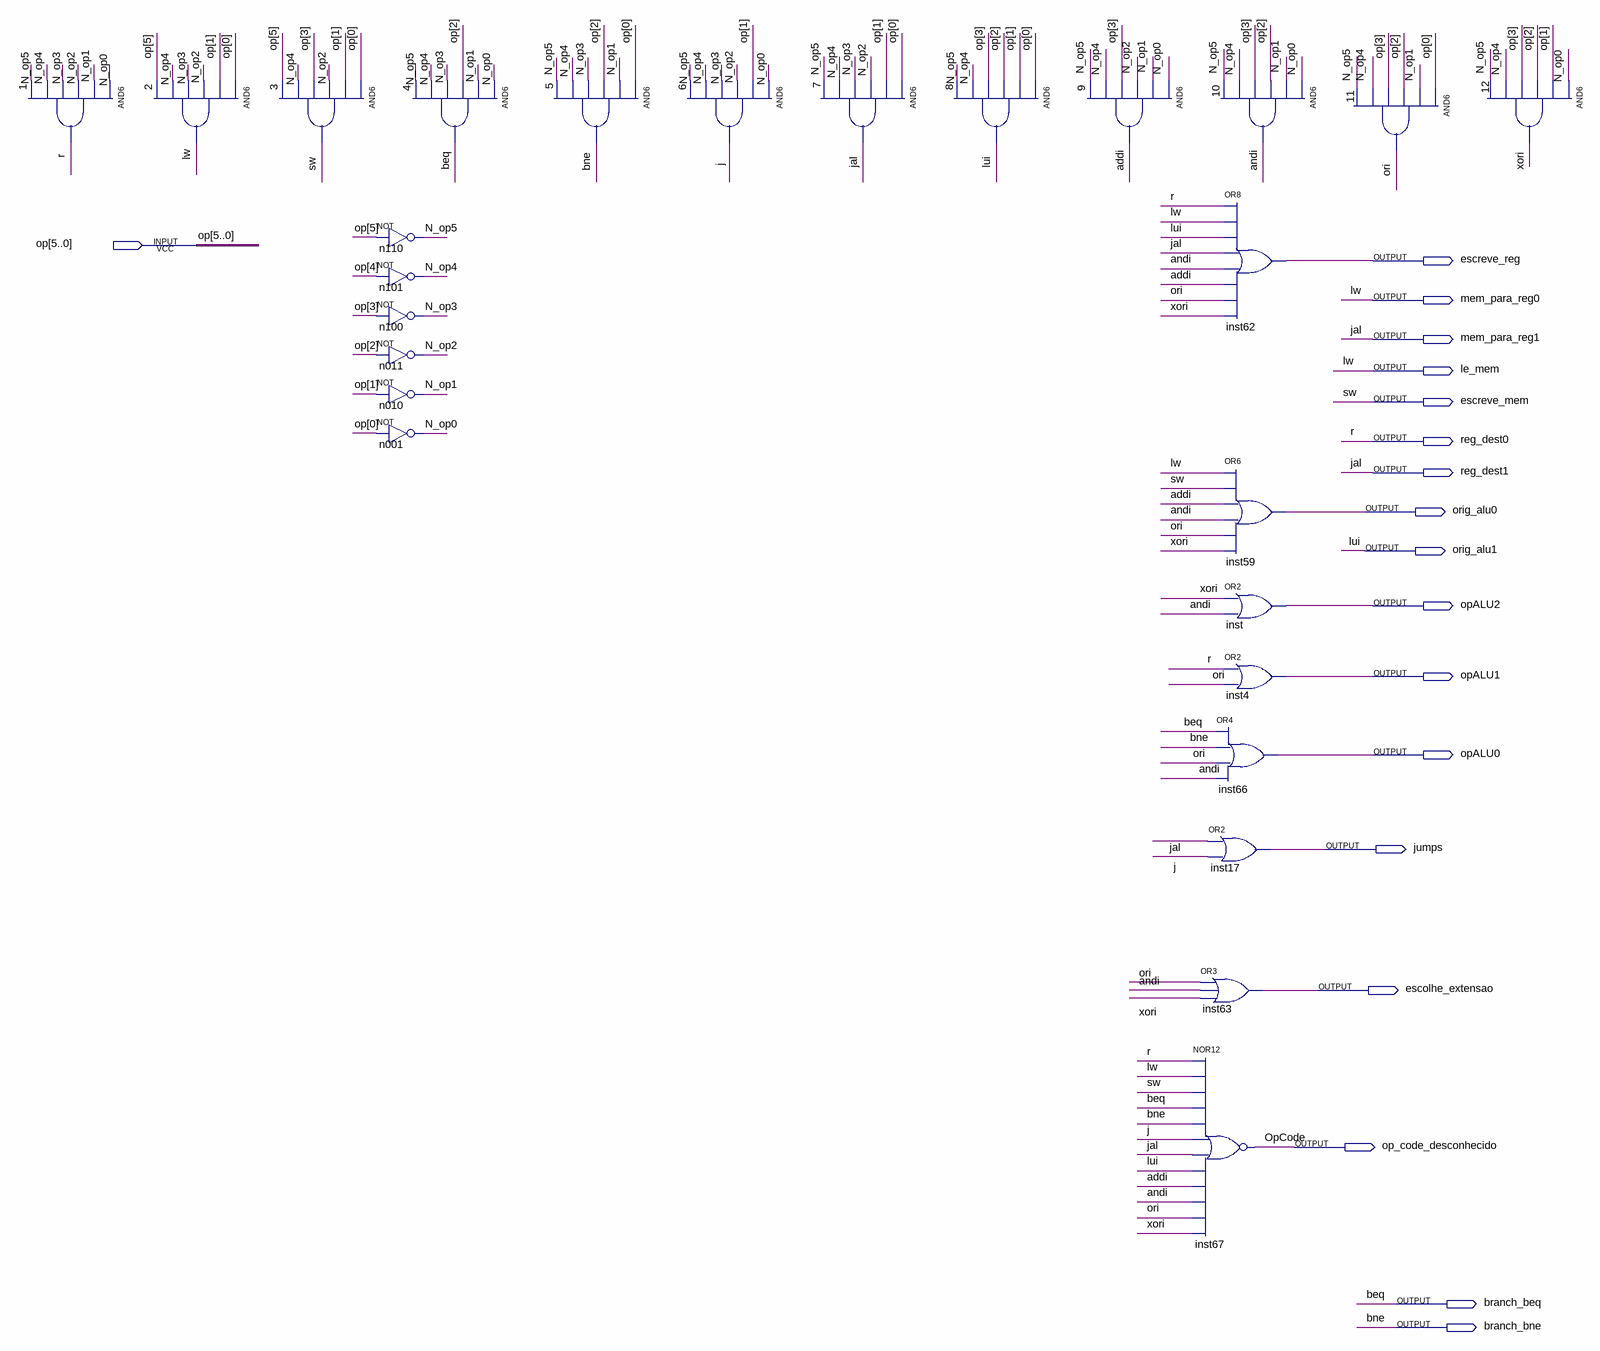
[diagram p0: schematic sheet]
// Quartus schematic control.bdf as structural Verilog: 26 symbols, 18 pins
module control (
  input  [5:0] op,
  output escreve_reg,
  output mem_para_reg0,
  output mem_para_reg1,
  output le_mem,
  output escreve_mem,
  output reg_dest0,
  output reg_dest1,
  output orig_alu0,
  output orig_alu1,
  output opALU2,
  output opALU1,
  output opALU0,
  output jumps,
  output escolhe_extensao,
  output op_code_desconhecido,
  output branch_beq,
  output branch_bne
);

  wire addi, andi, j, N_op0, N_op1, N_op2, N_op3, N_op4, N_op5, ori, xori;

  and u_1 (reg_dest0, N_op0, N_op1, N_op2, N_op3, N_op4, N_op5);
  and u_2 (le_mem, op[0], op[1], N_op2, N_op3, N_op4, op[5]);
  and u_3 (escreve_mem, op[0], op[1], N_op2, op[3], N_op4, op[5]);
  not n110 (N_op5, op[5]);
  not n101 (N_op4, op[4]);
  not n100 (N_op3, op[3]);
  not n011 (N_op2, op[2]);
  not n010 (N_op1, op[1]);
  not n001 (N_op0, op[0]);
  and u_4 (branch_beq, N_op0, N_op1, op[2], N_op3, N_op4, N_op5);
  and u_5 (branch_bne, op[0], N_op1, op[2], N_op3, N_op4, N_op5);
  and u_6 (j, N_op0, op[1], N_op2, N_op3, N_op4, N_op5);
  and u_7 (mem_para_reg1, op[0], op[1], N_op2, N_op3, N_op4, N_op5);
  and u_8 (orig_alu1, op[0], op[1], op[2], op[3], N_op4, N_op5);
  and u_9 (addi, N_op0, N_op1, N_op2, op[3], N_op4, N_op5);
  and u_10 (andi, N_op0, N_op1, op[2], op[3], N_op4, N_op5);
  or inst17 (jumps, mem_para_reg1, j);
  or inst63 (escolhe_extensao, ori, andi, xori);
  nor inst67 (op_code_desconhecido, reg_dest0, le_mem, escreve_mem, branch_beq, branch_bne, j, mem_para_reg1, orig_alu1, addi, andi, ori, xori);
  or inst62 (escreve_reg, reg_dest0, le_mem, orig_alu1, mem_para_reg1, andi, addi, ori, xori);
  or inst59 (orig_alu0, le_mem, escreve_mem, addi, andi, ori, xori);
  or inst (opALU2, xori, andi);
  or inst4 (opALU1, reg_dest0, ori);
  or inst66 (opALU0, branch_beq, branch_bne, ori, andi);
  and u_11 (ori, op[0], N_op1, op[2], op[3], N_op4, N_op5);
  and u_12 (xori, N_op0, op[1], op[2], op[3], N_op4, N_op5);

  assign mem_para_reg0 = le_mem;
  assign reg_dest1 = mem_para_reg1;

  // Other names for the same wires on the sheet: beq = branch_beq; bne = branch_bne; jal = mem_para_reg1;
  //   lui = orig_alu1; lw = le_mem; OpCode = op_code_desconhecido; r = reg_dest0; sw = escreve_mem
endmodule
